# EAGLE schematic TrackerSłonecznyv2 (EAGLE 9.6.2)
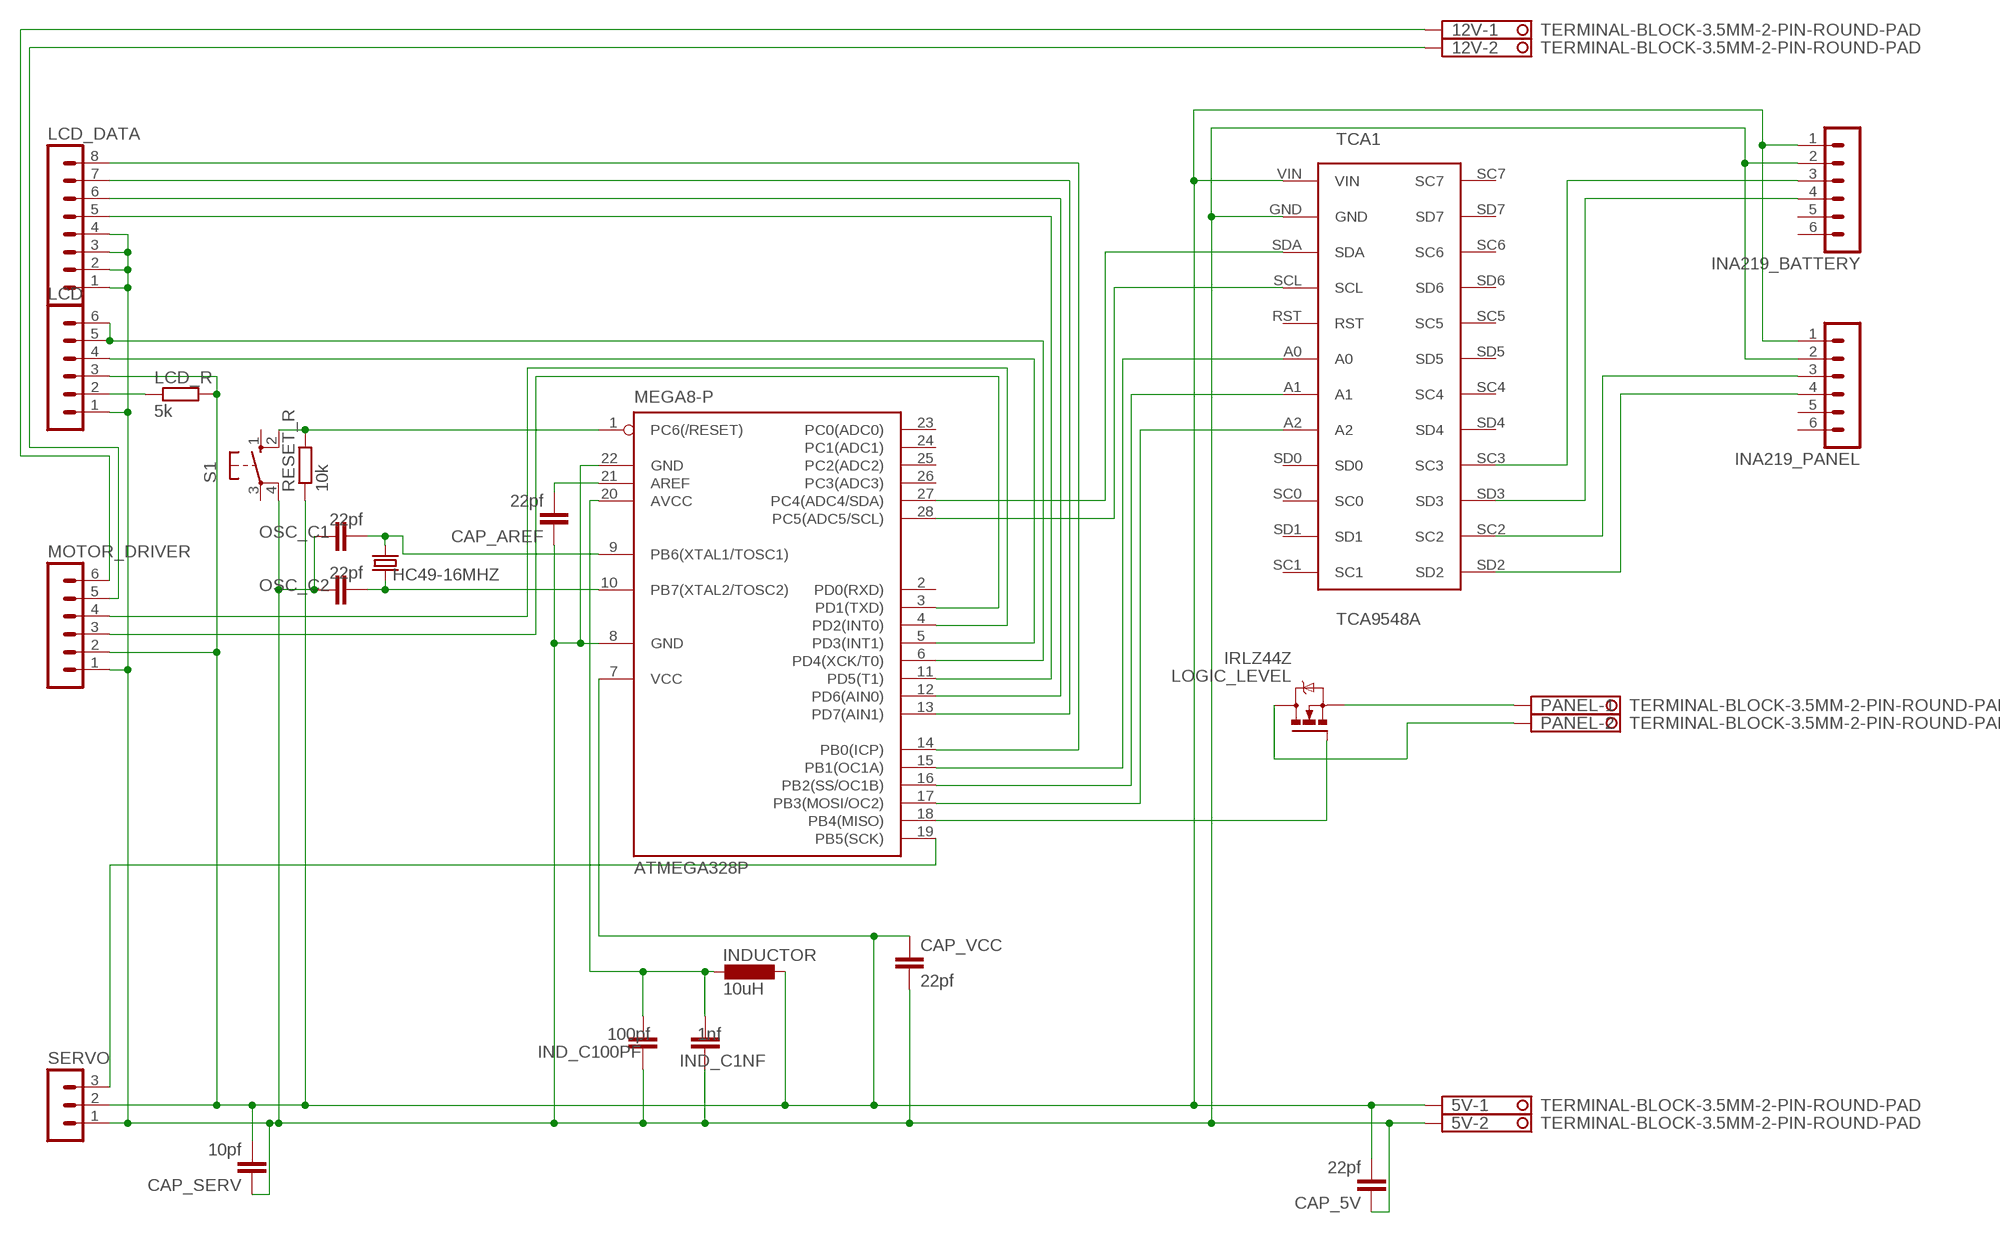
[diagram p0: schematic, sheet 1]

## Parts
5V  TERMINAL-BLOCK-3.5MM-2-PIN-ROUND-PAD  [TERMINAL-BLOCK-2-PIN-3.5MM-ROUND-PAD]
12V  TERMINAL-BLOCK-3.5MM-2-PIN-ROUND-PAD  [TERMINAL-BLOCK-2-PIN-3.5MM-ROUND-PAD]
ATMEGA328P  MEGA8-P  [DIL28-3]
CAP_5V  22pf  C-EU025-024X044  [C025-024X044]
CAP_AREF  22pf  C-EU025-024X044  [C025-024X044]
CAP_SERV  10pf  C-EU025-024X044  [C025-024X044]
CAP_VCC  22pf  C-EU025-024X044  [C025-024X044]
HC49-16MHZ  CRYTALHC49S  [HC49/S]
INA219_BATTERY  MA06-1  [MA06-1]
INA219_PANEL  MA06-1  [MA06-1]
IND_C1NF  1nf  C-EU025-024X044  [C025-024X044]
IND_C100PF  100pf  C-EU025-024X044  [C025-024X044]
INDUCTOR  10uH  L-EU0207/2V  [0207/2V]
LCD  MA06-1  [MA06-1]
LCD_DATA  MA08-1  [MA08-1]
LCD_R  5k  R-EU_0207/2V  [0207/2V]
LOGIC_LEVEL  IRLZ44Z  [TO220BH]
MOTOR_DRIVER  MA06-1  [MA06-1]
OSC_C1  22pf  C-EU025-024X044  [C025-024X044]
OSC_C2  22pf  C-EU025-024X044  [C025-024X044]
PANEL  TERMINAL-BLOCK-3.5MM-2-PIN-ROUND-PAD  [TERMINAL-BLOCK-2-PIN-3.5MM-ROUND-PAD]
RESET_R  10k  R-EU_0207/2V  [0207/2V]
S1  10-XX  [B3F-10XX]
SERVO  MA03-1  [MA03-1]
TCA1  TCA9548A  [TCA9548A]

## Nets
5V: 5V.1 ATMEGA328P.7(VCC) CAP_5V.2 CAP_SERV.2 CAP_VCC.1 INA219_BATTERY.1 INA219_PANEL.1 INDUCTOR.1 LCD.3 LCD_R.2 MOTOR_DRIVER.2 RESET_R.1 SERVO.2 TCA1.VIN
12V: 12V.1 MOTOR_DRIVER.6
BATTERY_VCC_IN: LOGIC_LEVEL.D PANEL.2
GND: 5V.2 ATMEGA328P.8(GND) ATMEGA328P.22(GND) CAP_5V.1 CAP_AREF.1 CAP_SERV.1 CAP_VCC.2 INA219_BATTERY.2 INA219_PANEL.2 IND_C1NF.1 IND_C100PF.1 LCD.1 LCD_DATA.1 LCD_DATA.2 LCD_DATA.3 LCD_DATA.4 MOTOR_DRIVER.1 OSC_C1.1 OSC_C2.1 S1.4(P1) SERVO.1 TCA1.GND
GND_12V: 12V.2 MOTOR_DRIVER.5
N$1: ATMEGA328P.15(PB1(OC1A)) TCA1.A0
N$2: ATMEGA328P.9(PB6(XTAL1/TOSC1)) HC49-16MHZ.1 OSC_C1.2
N$3: ATMEGA328P.10(PB7(XTAL2/TOSC2)) HC49-16MHZ.2 OSC_C2.2
N$4: ATMEGA328P.18(PB4(MISO)) LOGIC_LEVEL.G
N$5: ATMEGA328P.19(PB5(SCK)) SERVO.3
N$6: LCD.2 LCD_R.1
N$7: ATMEGA328P.16(PB2(SS/OC1B)) TCA1.A1
N$8: ATMEGA328P.11(PD5(T1)) LCD_DATA.5
N$9: ATMEGA328P.3(PD1(TXD)) MOTOR_DRIVER.3
N$10: ATMEGA328P.4(PD2(INT0)) MOTOR_DRIVER.4
N$11: ATMEGA328P.12(PD6(AIN0)) LCD_DATA.6
N$12: ATMEGA328P.13(PD7(AIN1)) LCD_DATA.7
N$13: ATMEGA328P.14(PB0(ICP)) LCD_DATA.8
N$14: INA219_BATTERY.3 TCA1.SC3
N$15: INA219_BATTERY.4 TCA1.SD3
N$16: ATMEGA328P.6(PD4(XCK/T0)) LCD.5 LCD.6
N$17: INA219_PANEL.3 TCA1.SC2
N$18: ATMEGA328P.5(PD3(INT1)) LCD.4
N$19: INA219_PANEL.4 TCA1.SD2
N$20: ATMEGA328P.27(PC4(ADC4/SDA)) TCA1.SDA
N$21: ATMEGA328P.28(PC5(ADC5/SCL)) TCA1.SCL
N$22: ATMEGA328P.17(PB3(MOSI/OC2)) TCA1.A2
N$25: ATMEGA328P.21(AREF) CAP_AREF.2
N$26: ATMEGA328P.1(PC6(/RESET)) RESET_R.2 S1.2(S1)
N$28: ATMEGA328P.20(AVCC) IND_C1NF.2 IND_C100PF.2 INDUCTOR.2
PANEL_VCC_OUT: LOGIC_LEVEL.S PANEL.1
Unconnected: ATMEGA328P.2(PD0(RXD)) ATMEGA328P.23(PC0(ADC0)) ATMEGA328P.24(PC1(ADC1)) ATMEGA328P.25(PC2(ADC2)) ATMEGA328P.26(PC3(ADC3)) INA219_BATTERY.5 INA219_BATTERY.6 INA219_PANEL.5 INA219_PANEL.6 S1.1(S) S1.3(P) TCA1.RST TCA1.SC0 TCA1.SC1 TCA1.SC4 TCA1.SC5 TCA1.SC6 TCA1.SC7 TCA1.SD0 TCA1.SD1 TCA1.SD4 TCA1.SD5 TCA1.SD6 TCA1.SD7

## Library data of the parts
5V 12V PANEL = Rembrandt Electronics - Terminal Block 3-5mm v1-0:TERMINAL-BLOCK-3.5MM-2-PIN: Terminal Block 3.5mm Pitch: 3,5 mm Number of pins: 2 Created by Rembrandt Electronics www.rembrandtelectronics.com
ATMEGA328P = atmel:MEGA8-P: MICROCONTROLLER 8 Kbytes FLASH, 1 kbytes SRAM, 512 bytes EEPROM, USART, 4-channel 10 bit ADC, 2-channel 8 bit ADC Pin compatible with Atmega48, ATMega88, ATMega168 Source: avr.lbr; OC_FARNELL: unknown; OC_NEWARK: unknown
CAP_5V CAP_AREF CAP_SERV CAP_VCC IND_C1NF IND_C100PF OSC_C1 OSC_C2 = rcl:C-EU: CAPACITOR, European symbol; SPICEPREFIX: C
HC49-16MHZ = crystal:CRYTAL: CRYSTAL
INA219_BATTERY INA219_PANEL LCD MOTOR_DRIVER = con-lstb:MA06-1: PIN HEADER; OC_FARNELL: unknown; OC_NEWARK: unknown
INDUCTOR = rcl:L-EU: INDUCTOR, European symbol; SPICEPREFIX: L
LCD_DATA = con-lstb:MA08-1: PIN HEADER; OC_FARNELL: unknown; OC_NEWARK: unknown
LCD_R RESET_R = rcl:R-EU_: RESISTOR, European symbol; SPICEPREFIX: R
LOGIC_LEVEL = transistor-power:IRLZ44Z: N-Channel HEXFET® Power MOSFET Logic Level AUTOMOTIVE MOSFET Source: http://www.irf.com/product-info/datasheets/data/irlz44zpbf.pdf
S1 = switch-omron:10-XX: OMRON SWITCH; MPN: B3F-1000; OC_FARNELL: 176432; OC_NEWARK: 36M3542
SERVO = con-lstb:MA03-1: PIN HEADER; OC_FARNELL: unknown; OC_NEWARK: unknown
TCA1 = TrackerSłonecznyLIB:TCA9548A